# EAGLE design CUBO4X4X4 (EAGLE 7.2.0)
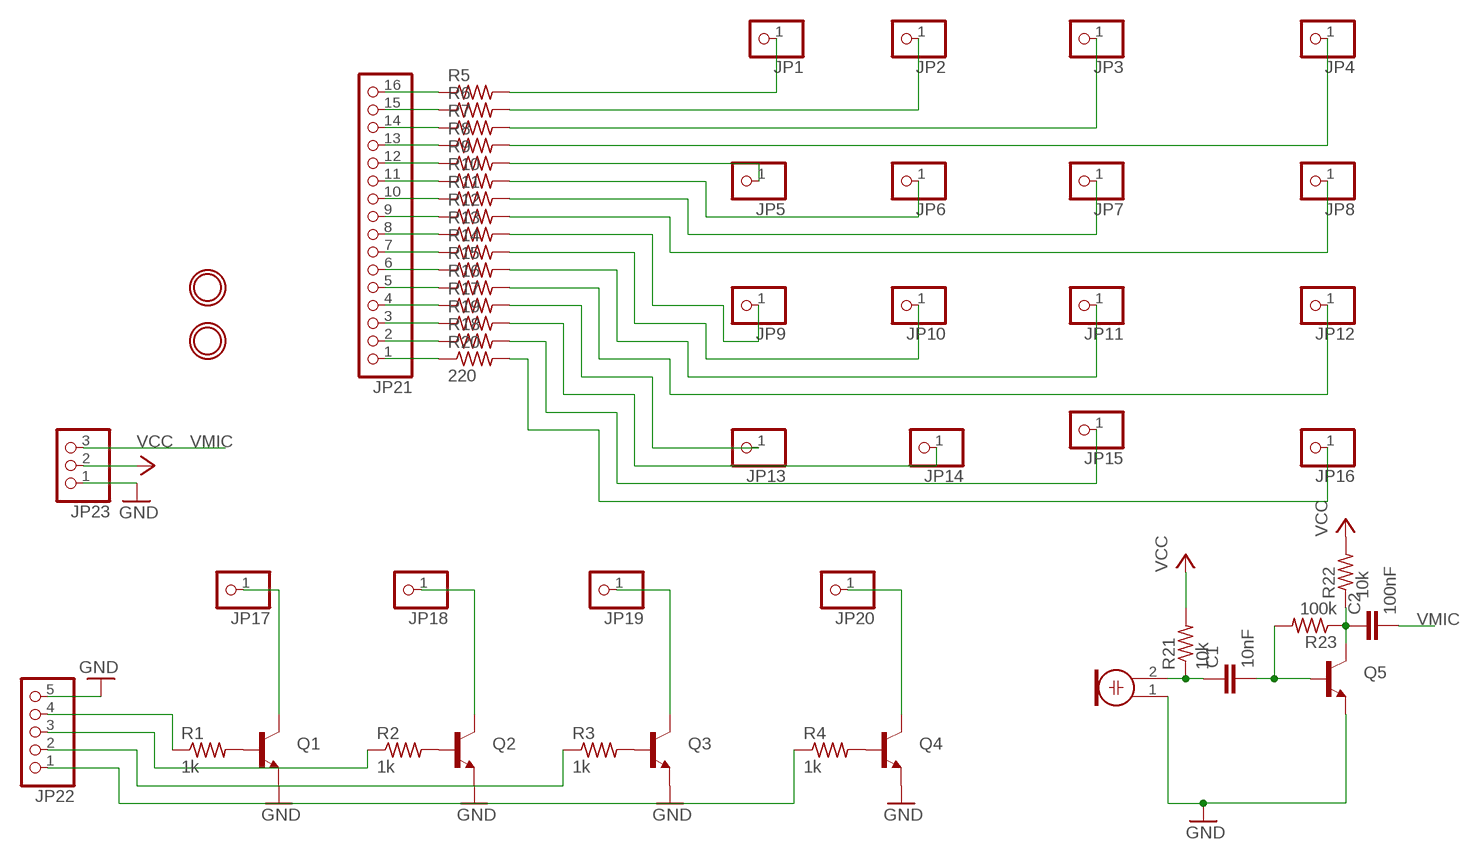
[diagram p0: schematic, sheet 1]

## Parts
C1  10nF  C2.5/2  [C2.5-2]
C2  100nF  C2.5/2  [C2.5-2]
JP1  PINHD-1X1  [1X01]
JP2  PINHD-1X1  [1X01]
JP3  PINHD-1X1  [1X01]
JP4  PINHD-1X1  [1X01]
JP5  PINHD-1X1  [1X01]
JP6  PINHD-1X1  [1X01]
JP7  PINHD-1X1  [1X01]
JP8  PINHD-1X1  [1X01]
JP9  PINHD-1X1  [1X01]
JP10  PINHD-1X1  [1X01]
JP11  PINHD-1X1  [1X01]
JP12  PINHD-1X1  [1X01]
JP13  PINHD-1X1  [1X01]
JP14  PINHD-1X1  [1X01]
JP15  PINHD-1X1  [1X01]
JP16  PINHD-1X1  [1X01]
JP17  PINHD-1X1  [1X01]
JP18  PINHD-1X1  [1X01]
JP19  PINHD-1X1  [1X01]
JP20  PINHD-1X1  [1X01]
JP21  PINHD-1X16  [1X16]
JP22  PINHD-1X5  [1X05]
JP23  PINHD-1X3  [1X03]
M1  ELECTRET_MICROPHON-WM.64PN  [WM-64PN]
Q1  TRANSISTOR_NPNTO-92-AMMO  [TO-92-AMMO]
Q2  TRANSISTOR_NPNTO-92-AMMO  [TO-92-AMMO]
Q3  TRANSISTOR_NPNTO-92-AMMO  [TO-92-AMMO]
Q4  TRANSISTOR_NPNTO-92-AMMO  [TO-92-AMMO]
Q5  TRANSISTOR_NPNTO-92-AMMO  [TO-92-AMMO]
R1  1k  R-US_0207/10  [0207/10]
R2  1k  R-US_0207/10  [0207/10]
R3  1k  R-US_0207/10  [0207/10]
R4  1k  R-US_0207/10  [0207/10]
R5  R-US_0207/10  [0207/10]
R6  R-US_0207/10  [0207/10]
R7  R-US_0207/10  [0207/10]
R8  R-US_0207/10  [0207/10]
R9  R-US_0207/10  [0207/10]
R10  R-US_0207/10  [0207/10]
R11  R-US_0207/10  [0207/10]
R12  R-US_0207/10  [0207/10]
R13  R-US_0207/10  [0207/10]
R14  R-US_0207/10  [0207/10]
R15  R-US_0207/10  [0207/10]
R16  R-US_0207/10  [0207/10]
R17  R-US_0207/10  [0207/10]
R18  R-US_0207/10  [0207/10]
R19  R-US_0207/10  [0207/10]
R20  220  R-US_0207/10  [0207/10]
R21  10k  R-US_0207/10  [0207/10]
R22  10k  R-US_0207/10  [0207/10]
R23  100k  R-US_0207/10  [0207/10]
U$7  MOUNTINGHOLE2.5_THICK  [MOUNTINGHOLE_2.5_PLATED_THICK]
U$8  MOUNTINGHOLE2.5_THICK  [MOUNTINGHOLE_2.5_PLATED_THICK]

## Nets
GND: JP22.5 JP23.1 M1.1 Q1.1(E) Q2.1(E) Q3.1(E) Q4.1(E) Q5.1(E)
N$1: JP17.1 Q1.3(C)
N$2: JP18.1 Q2.3(C)
N$3: JP19.1 Q3.3(C)
N$4: Q1.2(B) R1.2
N$5: Q2.2(B) R2.2
N$6: Q3.2(B) R3.2
N$7: Q4.2(B) R4.2
N$8: JP20.1 Q4.3(C)
N$9: JP21.16 R5.1
N$10: JP21.15 R6.1
N$11: JP21.14 R7.1
N$12: JP21.13 R8.1
N$13: JP21.12 R9.1
N$14: JP21.11 R10.1
N$15: JP21.10 R11.1
N$16: JP21.9 R12.1
N$17: JP21.8 R13.1
N$18: JP21.7 R14.1
N$19: JP21.6 R15.1
N$20: JP21.5 R16.1
N$21: JP21.4 R17.1
N$22: JP21.3 R19.1
N$23: JP21.2 R18.1
N$24: JP21.1 R20.1
N$25: JP1.1 R5.2
N$26: JP2.1 R6.2
N$27: JP3.1 R7.2
N$28: JP4.1 R8.2
N$29: JP5.1 R9.2
N$30: JP6.1 R10.2
N$31: JP7.1 R11.2
N$32: JP8.1 R12.2
N$33: JP9.1 R13.2
N$34: JP10.1 R14.2
N$35: JP11.1 R15.2
N$36: JP12.1 R16.2
N$37: JP13.1 R17.2
N$38: JP14.1 R19.2
N$39: JP15.1 R18.2
N$40: JP16.1 R20.2
N$41: JP22.4 R1.1
N$42: JP22.3 R2.1
N$43: JP22.2 R3.1
N$44: JP22.1 R4.1
N$45: C1.1 M1.2 R21.1
N$46: C1.2 Q5.2(B) R23.2
VCC: JP23.2 R21.2 R22.2
VMIC: C2.1 C2.2 JP23.3 Q5.3(C) R22.1 R23.1

## Library data of the parts
C1 C2 = capacitor-wima:C: CAPACITOR naming: grid - package width
JP1-JP20 = pinhead:PINHD-1X1: PIN HEADER
JP21 = pinhead:PINHD-1X16: PIN HEADER
JP22 = pinhead:PINHD-1X5: PIN HEADER
JP23 = pinhead:PINHD-1X3: PIN HEADER
M1 = microphon:ELECTRET_MICROPHON-: Electret Condenser Microphone
Q1-Q5 = SparkFun-DiscreteSemi:TRANSISTOR_NPN: Generic NPN BJT MMBT2222A - TRANS-08049 (SOT-23, 1A 40V) MPSA42 - TRANS-09116 (SOT-23, 500mA 300V) MMBT5088LT1G - TRANS-11160 (SOT-23, 50 mA 30V) BC547 - COM-08928 <http://www.sparkfun.com/products/8928> (TO-92 45V 100mA) (1.Collector 2.Base 3.Emitter) 2N3904 - COM-00521 <http://www.sparkfun.com/products/521> (TO-92 40V 200mA) (1.Emitter 2.Base 3.Collector) P2N2222A - COM-12852 <http://www.sparkfun.com/products/12852> (TO-92 40V 600mA) (1.Collector 2.Base 3.Emitter)
R1-R23 = rcl:R-US_: RESISTOR, American symbol
U$7 U$8 = microbuilder:MOUNTINGHOLE: Mounting Hole For #2 screws (0.086"/2.18mm width, 0.094"/2.4mm hole) use 2.5mm

## Board
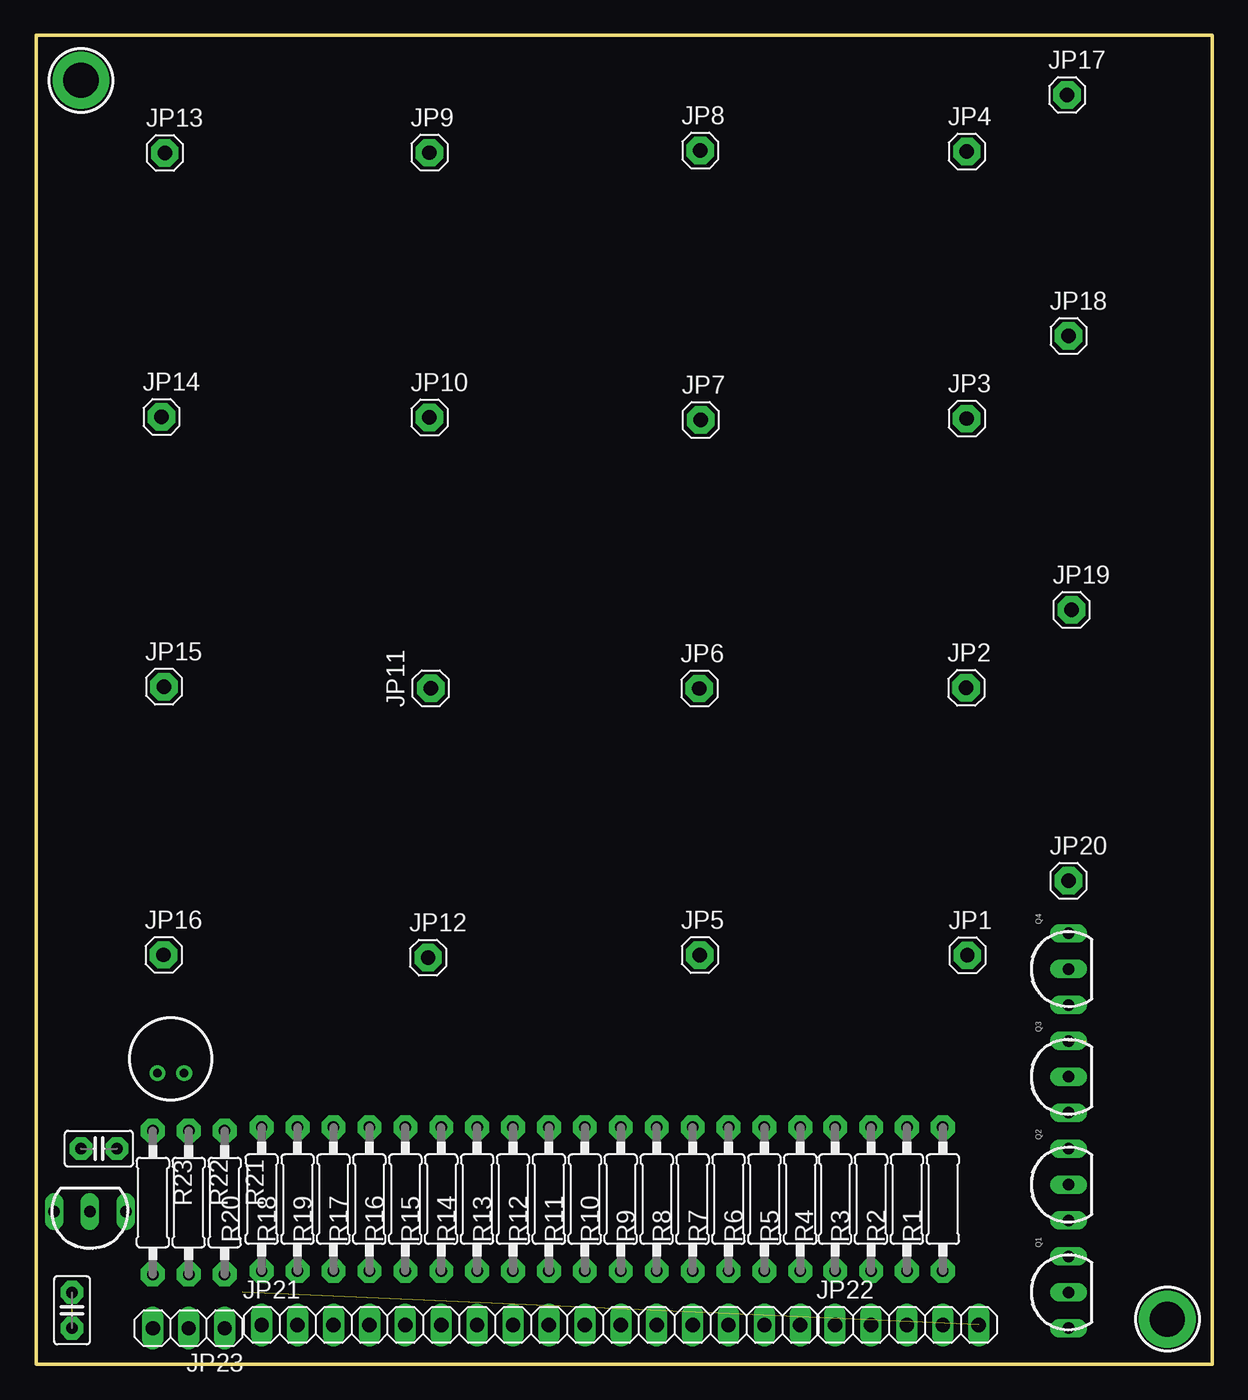
[diagram p1: board, top side]
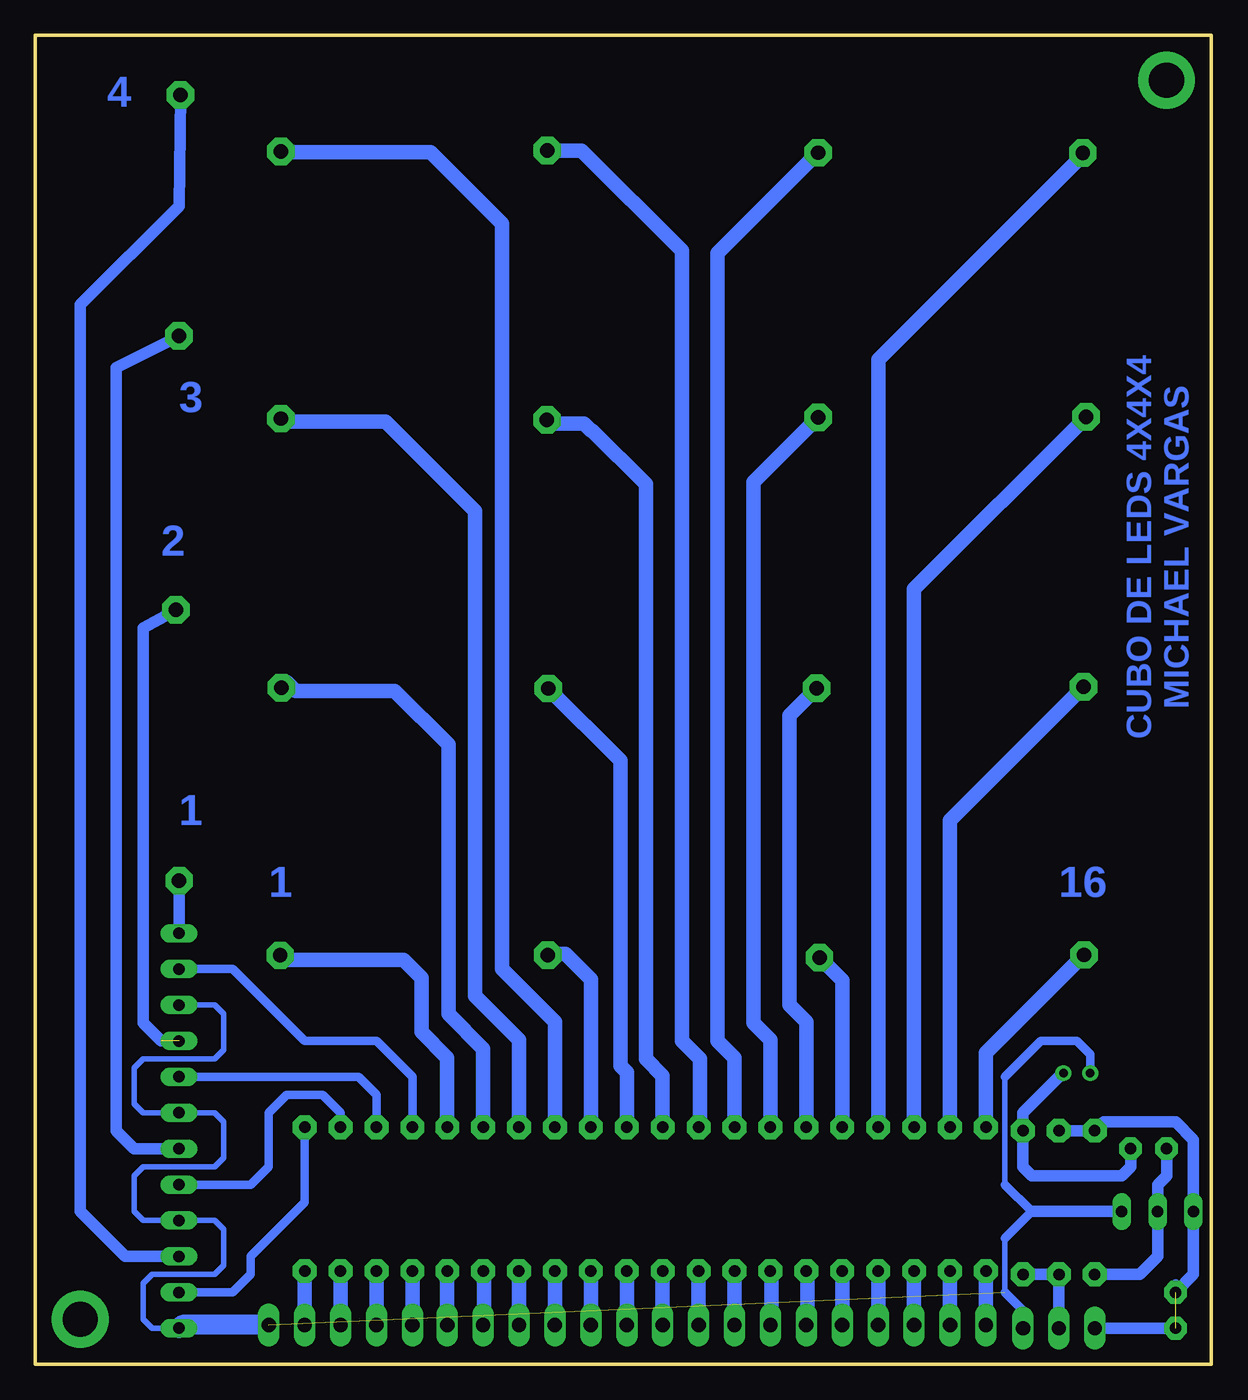
[diagram p2: board, bottom side, seen from below]

Size 83.19 x 93.98 mm. Coordinates in mm from the lower left corner, seen from the top.
Outline: 83.19,0 0,0 0,93.98 83.19,93.98 83.19,0
Copper layers (1*16): Top 0.035mm / dielectric 1.5mm / Bottom 0.035mm
Design rules "default": minimum track width 10mil, minimum drill 24mil, track to track 8mil, track to pad 8mil, pad to pad 8mil, via to via 8mil, smd to smd 8mil, copper to edge 40mil, drill to drill 8mil, minimum pad ring 10mil, minimum via ring 8mil, stop-mask expansion 4mil, vias tented up to drill 0mil, thermal gap 10mil

### Footprints (pad centres in the part's own frame; a part is rotated, then mirrored left to right if it is on the bottom)
C2.5-2 = drill 0.813 pad 1.6 octagon: 1 -1.27,0; 2 1.27,0
1X01 = drill 1.016 pad 1.93 octagon: 1 0,0
1X16 = drill 1.016 long: 1 -19.05,0; 2 -16.51,0; 3 -13.97,0; 4 -11.43,0; 5 -8.89,0; 6 -6.35,0; 7 -3.81,0; 8 -1.27,0; 9 1.27,0; 10 3.81,0; 11 6.35,0; 12 8.89,0; 13 11.43,0; 14 13.97,0; 15 16.51,0; 16 19.05,0
1X05 = drill 1.016 long: 1 -5.08,0; 2 -2.54,0; 3 0,0; 4 2.54,0; 5 5.08,0
1X03 = drill 1.016 long: 1 -2.54,0; 2 0,0; 3 2.54,0
WM-64PN = drill 0.6 pad 1: 1 -1,0.95; 2 -1,-0.95
TO-92-AMMO = drill 0.813 long: 1 -2.54,0; 2 0,0; 3 2.54,0
0207/10 = drill 0.813 pad 1.676 octagon: 1 -5.08,0; 2 5.08,0
MOUNTINGHOLE_2.5_PLATED_THICK = drill 2.5 pad 4: P$1 0,0

### Placement (x,y rotation side)
C1  4.45,15.24 180 top
C2  2.54,3.81 270 top
JP1  65.87,28.91 0 top
JP2  65.78,47.84 0 top
JP3  65.82,66.87 0 top
JP4  65.83,85.77 0 top
JP5  46.94,28.93 0 top
JP6  46.91,47.79 0 top
JP7  47,66.78 0 top
JP8  46.98,85.83 0 top
JP9  27.82,85.68 0 top
JP10  27.82,66.96 0 top
JP11  27.91,47.81 90 top
JP12  27.72,28.75 0 top
JP13  9.1,85.66 0 top
JP14  8.87,67 0 top
JP15  9.04,47.91 0 top
JP16  9.02,28.94 0 top
JP17  72.92,89.76 0 top
JP18  73.03,72.72 0 top
JP19  73.24,53.34 0 top
JP20  73.02,34.18 0 top
JP21  35.01,2.78 0 top
JP22  61.59,2.78 0 top
JP23  10.8,2.54 180 top
M1  9.52,21.59 90 top
Q1  73.03,5.08 90 top
Q2  73.03,12.7 90 top
Q3  73.03,20.32 90 top
Q4  73.03,27.94 90 top
Q5  3.81,10.79 180 top
R1  64.14,11.67 90 top
R2  61.59,11.67 90 top
R3  59.06,11.67 90 top
R4  56.52,11.67 90 top
R5  54.05,11.67 90 top
R6  51.52,11.67 90 top
R7  48.98,11.67 90 top
R8  46.44,11.67 90 top
R9  43.9,11.67 90 top
R10  41.36,11.67 90 top
R11  38.82,11.67 90 top
R12  36.28,11.67 90 top
R13  33.73,11.67 90 top
R14  31.2,11.67 90 top
R15  28.66,11.67 90 top
R16  26.12,11.67 90 top
R17  23.58,11.67 90 top
R18  18.5,11.67 90 top
R19  21.04,11.67 90 top
R20  15.96,11.67 90 top
R21  13.34,11.43 270 top
R22  10.8,11.43 270 top
R23  8.26,11.43 270 top
U$7  3.18,90.81 0 top
U$8  80.01,3.18 0 top

### Tracks (layer width: path | path; a pad name or v marks a point on that pad's centre or on a via)
GND  (1 unrouted)
  Bottom 0.406: Q1.1 74.93,2.54 75.56,3.18 75.56,5.72 74.93,6.35 70.48,6.35 69.85,6.99 69.85,9.53 70.48,10.16 Q2.1 75.56,10.16 76.2,10.79 76.2,13.34 75.56,13.97 70.48,13.97 69.85,14.61 69.85,17.15 70.48,17.78 Q3.1 75.56,17.78 76.2,18.41 76.2,20.95 75.56,21.59 70.48,21.59 69.85,22.23 69.85,24.77 70.48,25.4 Q4.1 | 14.61,20.32 14.61,12.7 | 14.61,8.89 14.61,5.08
  Bottom 0.61: M1.1 8.58,21.91 9.52,22.86 12.07,22.86 14.61,20.32 | 14.61,12.7 12.7,10.79 14.61,8.89 | 14.61,5.08 13.34,3.81 JP23.1
  Bottom 0.813: Q5.1 12.7,10.79
  Bottom 1.422: JP22.5 72.78,2.78 Q1.1
N$1
  Bottom 0.813: Q1.3 76.84,7.62 80.01,10.79 80.01,74.93 73.03,81.92 JP17.1
N$2
  Bottom 0.813: JP18.1 77.47,70.48 77.47,16.51 76.2,15.24 Q2.3
N$3  (1 unrouted)
  Bottom 0.813: JP19.1 75.56,52.07 75.56,24.13 74.3,22.86 | Q3.3 72.39,22.86
N$4
  Bottom 0.61: R1.2 64.14,11.43 67.94,7.62 67.94,6.35 69.22,5.08 Q1.2
N$5
  Bottom 0.61: R2.2 61.59,17.78 62.87,19.05 65.41,19.05 66.67,17.78 66.67,13.97 67.94,12.7 Q2.2
N$6
  Bottom 0.61: R3.2 59.06,19.05 60.33,20.32 Q3.2
N$7
  Bottom 0.61: R4.2 56.52,20.32 59.06,22.86 64.14,22.86 69.22,27.94 Q4.2
N$8
  Bottom 0.813: JP20.1 73.03,33.02 Q4.3
N$9
  Bottom 1.016: JP21.16 R5.1
N$10
  Bottom 1.016: JP21.15 51.44,2.86 51.44,6.35 51.52,6.43 R6.1
N$11
  Bottom 1.016: JP21.14 R7.1
N$12
  Bottom 1.016: JP21.13 R8.1
N$13
  Bottom 1.016: JP21.12 R9.1
N$14
  Bottom 1.016: JP21.11 R10.1
N$15
  Bottom 1.016: JP21.10 R11.1
N$16
  Bottom 1.016: JP21.9 R12.1
N$17
  Bottom 1.016: JP21.8 R13.1
N$18
  Bottom 1.016: JP21.7 31.12,2.86 31.12,6.35 31.2,6.43 R14.1
N$19
  Bottom 1.016: JP21.6 28.58,2.86 28.58,6.35 28.66,6.43 R15.1
N$20
  Bottom 1.016: JP21.5 R16.1
N$21
  Bottom 1.016: JP21.4 R17.1
N$22
  Bottom 1.016: JP21.3 R19.1
N$23
  Bottom 1.016: JP21.2 R18.1
N$24
  Bottom 1.016: JP21.1 R20.1
N$25
  Bottom 1.016: R5.2 54.05,21.67 55.88,23.5 55.88,27.3 57.15,28.57 65.53,28.57 JP1.1
N$26
  Bottom 1.016: R6.2 51.52,22.3 53.98,24.77 53.98,43.81 57.79,47.62 64.77,47.62 65.41,48.26 65.41,48.22 JP2.1
N$27
  Bottom 1.016: R7.2 48.98,22.94 52.07,26.04 52.07,60.33 58.42,66.67 65.62,66.67 JP3.1
N$28
  Bottom 1.016: R8.2 46.44,24.21 50.16,27.94 50.16,80.64 55.25,85.72 65.79,85.72 JP4.1
N$29
  Bottom 1.016: R9.2 43.9,27.22 45.69,29.02 46.86,29.02 JP5.1
N$30
  Bottom 1.016: R10.2 41.36,20.65 41.81,21.11 41.81,42.69 JP6.1
N$31
  Bottom 1.016: R11.2 38.82,20.4 40.01,21.59 40.01,62.23 43.82,66.04 43.89,66.04 44.36,66.52 46.74,66.52 JP7.1
N$32
  Bottom 1.016: JP8.1 44.56,85.83 37.47,78.74 37.47,22.86 36.2,21.59 36.2,16.83 R12.2
N$33
  Bottom 1.016: R13.2 33.73,21.67 34.93,22.86 34.93,78.58 JP9.1
N$34
  Bottom 1.016: R14.2 31.2,22.94 32.39,24.13 32.39,62.39 JP10.1
N$35
  Bottom 1.016: R15.2 28.66,24.21 29.85,25.4 29.85,45.87 JP11.1
N$36
  Bottom 1.016: R16.2 26.12,27.14 JP12.1
N$37
  Bottom 1.016: R17.2 23.58,71.04 9.52,85.09 9.52,85.24 JP13.1
N$38
  Bottom 1.016: R19.2 21.04,54.83 JP14.1
N$39
  Bottom 1.016: R18.2 18.5,38.46 JP15.1
N$40
  Bottom 1.016: R20.2 15.96,22 JP16.1
N$41
  Bottom 1.016: JP22.4 R1.1
N$42
  Bottom 1.016: JP22.3 R2.1
N$43
  Bottom 1.016: JP22.2 R3.1
N$44
  Bottom 1.016: JP22.1 R4.1
N$45
  Bottom 0.813: M1.2 10.52,20.59 13.34,17.78 R21.1 13.34,13.97 12.7,13.34 6.35,13.34 5.72,13.97 C1.1
N$46
  Bottom 0.813: C1.2 3.18,13.34 3.81,12.7 Q5.2 3.81,7.62 5.08,6.35 R23.2
VCC
  Bottom 0.813: R21.2 R22.2 JP23.2
VMIC  (1 unrouted)
  Bottom 0.61: C2.1 2.54,5.72
  Bottom 0.813: C2.1 1.27,6.35 Q5.3 1.27,15.88 2.54,17.15 7.62,17.15 R23.1 R22.1 | JP23.3 C2.2

### Text on the board
Bottom: 4 | 3 | CUBO DE LEDS 4X4X4 / MICHAEL VARGAS | 2 | 1 | 16 | 1